# EAGLE design TDA2822M (EAGLE 9.5.2)
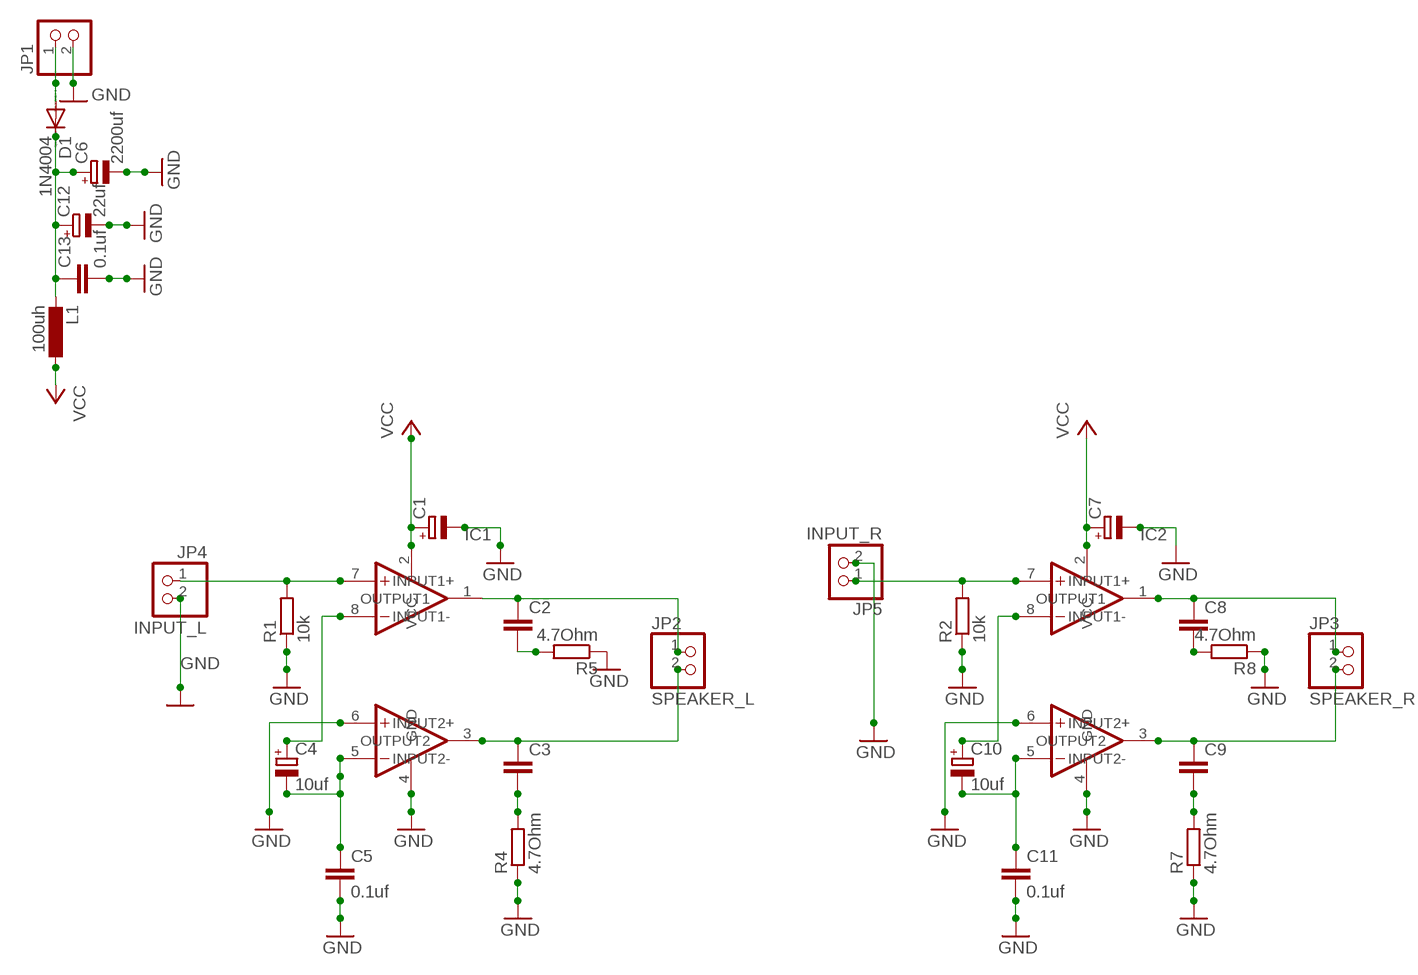
[diagram p0: schematic, sheet 1]

## Parts
C1  CPOL-EUE2.5-7  [E2,5-7]
C2  C-EU025_050-035X075  [C025_050-035X075]
C3  C-EU025_050-035X075  [C025_050-035X075]
C4  10uf  CPOL-EUE2.5-7  [E2,5-7]
C5  0.1uf  C-EU025_050-035X075  [C025_050-035X075]
C6  2200uf  CPOL-EUE3.5-8  [E3,5-8]
C7  CPOL-EUE2.5-7  [E2,5-7]
C8  C-EU025_050-035X075  [C025_050-035X075]
C9  C-EU025_050-035X075  [C025_050-035X075]
C10  10uf  CPOL-EUE2.5-7  [E2,5-7]
C11  0.1uf  C-EU025_050-035X075  [C025_050-035X075]
C12  22uf  CPOL-EUE3.5-8  [E3,5-8]
C13  0.1uf  C2,5-3  [C2.5-3]
D1  1N4004  [DO41-10]
IC1  TDA2822M  [DIL8]
IC2  TDA2822M  [DIL8]
JP1  PINHD-1X2  [1X02]
JP2  SPEAKER_L  PINHD-1X2  [1X02]
JP3  SPEAKER_R  PINHD-1X2  [1X02]
JP4  INPUT_L  PINHD-1X2  [1X02]
JP5  INPUT_R  PINHD-1X2  [1X02]
L1  100uh  L-EU0207/10  [0207/10]
R1  10k  R-EU_0207/10  [0207/10]
R2  10k  R-EU_0207/10  [0207/10]
R4  4.7Ohm  R-EU_0207/10  [0207/10]
R5  4.7Ohm  R-EU_0207/10  [0207/10]
R7  4.7Ohm  R-EU_0207/10  [0207/10]
R8  4.7Ohm  R-EU_0207/10  [0207/10]

## Nets
GND: C1.- C5.2 C6.- C7.- C11.2 C12.- C13.2 IC1.4(GND) IC1.6(INPUT2+) IC2.4(GND) IC2.6(INPUT2+) JP1.2 JP4.2 JP5.2 R1.1 R2.1 R4.1 R5.1 R7.1 R8.1
N$1: C4.+ IC1.8(INPUT1-)
N$2: C4.- C5.1 IC1.5(INPUT2-)
N$3: IC1.7(INPUT1+) JP4.1 R1.2
N$4: C6.+ C12.+ C13.1 D1.C L1.2
N$5: C3.1 IC1.3(OUTPUT2) JP2.2
N$6: C2.1 IC1.1(OUTPUT1) JP2.1
N$7: C3.2 R4.2
N$8: C2.2 R5.2
N$9: D1.A JP1.1
N$11: C9.1 IC2.3(OUTPUT2) JP3.2
N$12: C8.1 IC2.1(OUTPUT1) JP3.1
N$13: C9.2 R7.2
N$14: C8.2 R8.2
N$15: C10.+ IC2.8(INPUT1-)
N$16: C10.- C11.1 IC2.5(INPUT2-)
N$17: IC2.7(INPUT1+) JP5.1 R2.2
VCC: C1.+ C7.+ IC1.2(VCC) IC2.2(VCC) L1.1

## Library data of the parts
C1 C4 C6 C7 C10 C12 = rcl:CPOL-EU: POLARIZED CAPACITOR, European symbol
C2 C3 C5 C8 C9 C11 = resistor:C-EU: CAPACITOR, European symbol
C13 = capacitor-wima:C: CAPACITOR naming: grid - package width
D1 = diode:1N4004: DIODE general purpose rectifier, 1 A
IC1 IC2 = TDA2822M:TDA2822M: TDA2822M - DUAL LOW-VOLTAGE POWER AMPLIFIER
JP1-JP5 = pinhead:PINHD-1X2: PIN HEADER
L1 = rcl:L-EU: INDUCTOR, European symbol
R1 R2 R4 R5 R7 R8 = resistor:R-EU_: RESISTOR, European symbol

## Board
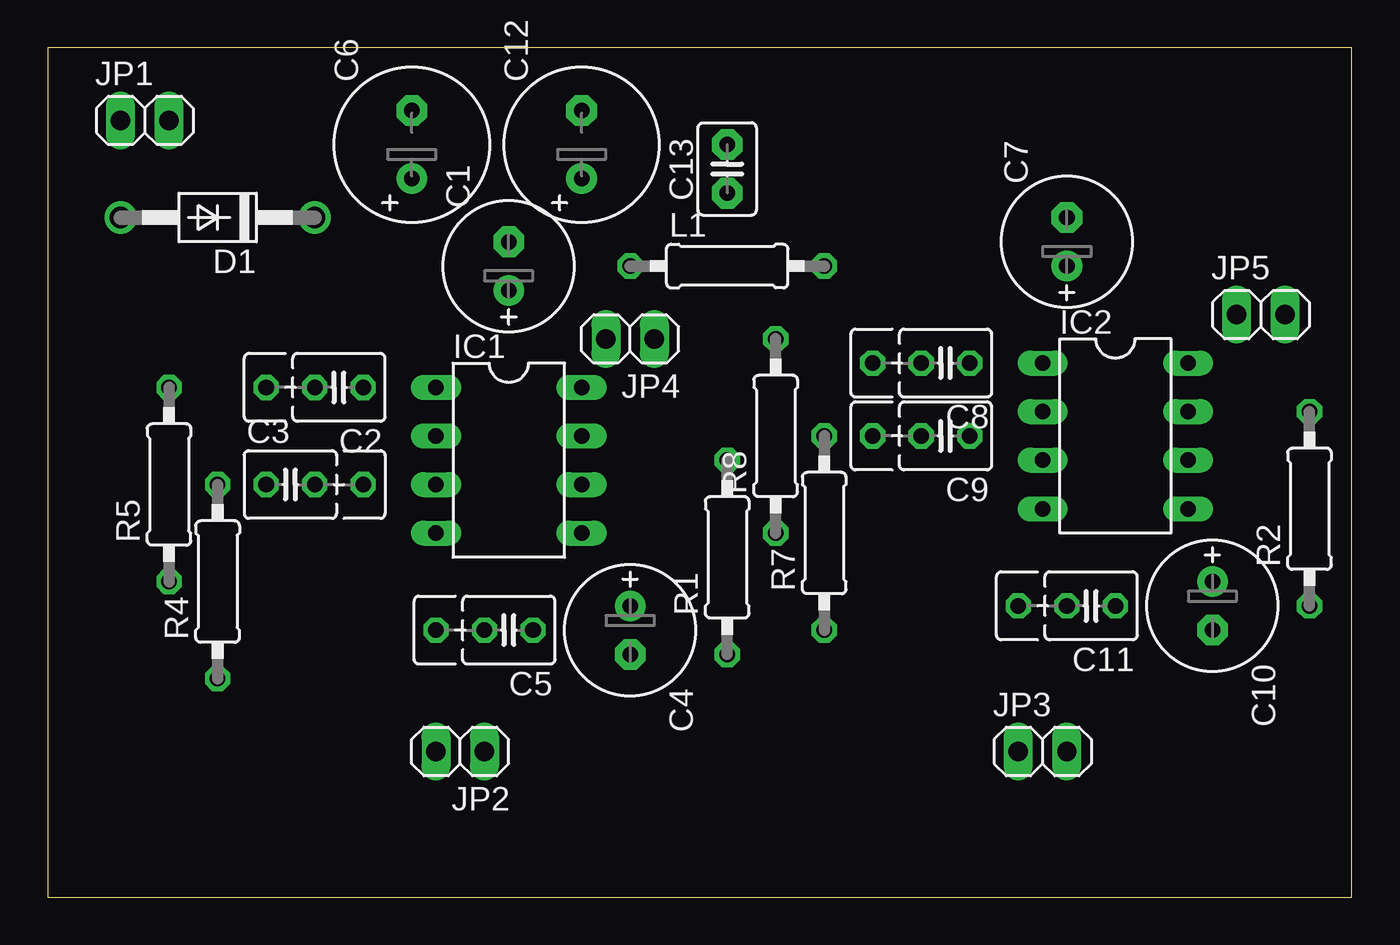
[diagram p1: board, top side]
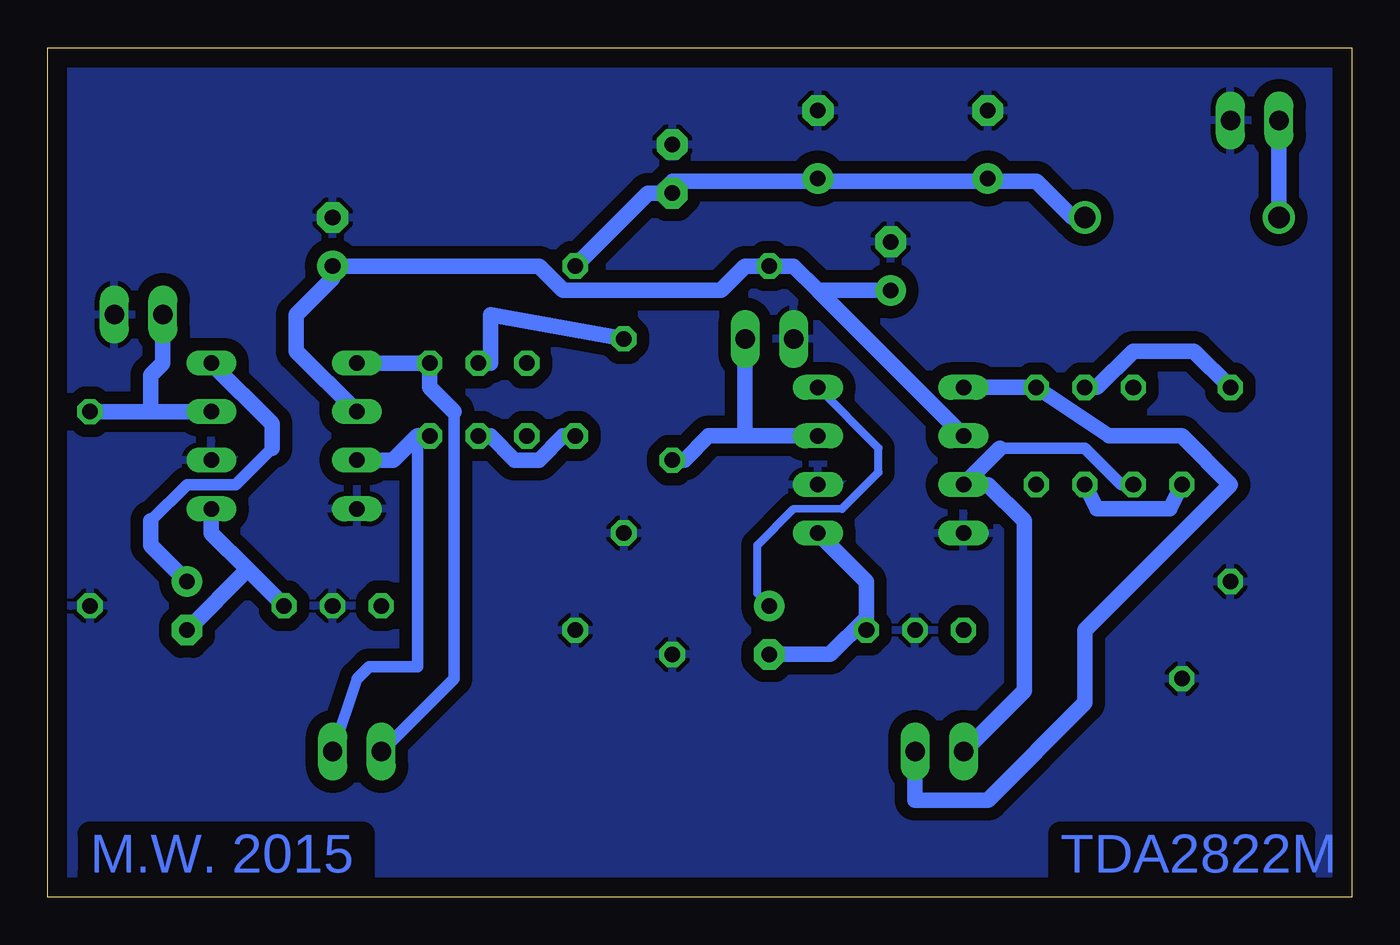
[diagram p2: board, bottom side, seen from below]

Size 68.25 x 44.44 mm. Coordinates in mm from the lower left corner, seen from the top.
Outline: 0,0 68.25,0 68.25,44.44 0,44.44 0,0
Copper layers (1*16): Top 0.035mm / dielectric 1.5mm / Bottom 0.035mm
Design rules "default *": minimum track width 15mil, minimum drill 30mil, track to track 8mil, track to pad 8mil, pad to pad 8mil, via to via 8mil, smd to smd 8mil, copper to edge 40mil, drill to drill 8mil, minimum pad ring 10mil, minimum via ring 8mil, stop-mask expansion 4mil, vias tented up to drill 0mil, thermal gap 10mil

### Footprints (pad centres in the part's own frame; a part is rotated, then mirrored left to right if it is on the bottom)
E2,5-7 = drill 0.813 pad 1.6: + -1.27,0 | drill 0.813 pad 1.6 octagon: - 1.27,0
C025_050-035X075 = drill 0.813 octagon: 1 -1.27,0; 2 1.27,0; 3 3.81,0
E3,5-8 = drill 0.813 pad 1.6: + -1.778,0 | drill 0.813 pad 1.6 octagon: - 1.778,0
C2.5-3 = drill 0.813 pad 1.6 octagon: 1 -1.27,0; 2 1.27,0
DO41-10 = drill 1.118: A 5.08,0; C -5.08,0
DIL8 = drill 0.813 long: 1 -3.81,-3.81; 2 -1.27,-3.81; 3 1.27,-3.81; 4 3.81,-3.81; 5 3.81,3.81; 6 1.27,3.81; 7 -1.27,3.81; 8 -3.81,3.81
1X02 = drill 1.016 long: 1 -1.27,0; 2 1.27,0
0207/10 = drill 0.813 octagon: 1 -5.08,0; 2 5.08,0

### Placement (x,y rotation side)
C1  24.13,33.02 90 top
C2  15.24,26.67 180 top
C3  12.7,21.59 0 top
C4  30.48,13.97 270 top
C5  24.13,13.97 180 top
C6  19.05,39.37 90 top
C7  53.34,34.29 90 top
C8  46.99,27.94 180 top
C9  46.99,24.13 180 top
C10  60.96,15.24 270 top
C11  54.61,15.24 180 top
C12  27.94,39.37 90 top
C13  35.56,38.1 90 top
D1  8.89,35.56 180 top
IC1  24.13,22.86 270 top
IC2  55.88,24.13 270 top
JP1  5.08,40.64 0 top
JP2  21.59,7.62 180 top
JP3  52.07,7.62 0 top
JP4  30.48,29.21 180 top
JP5  63.5,30.48 0 top
L1  35.56,33.02 0 top
R1  35.56,17.78 90 top
R2  66.04,20.32 90 top
R4  8.89,16.51 90 top
R5  6.35,21.59 90 top
R7  40.64,19.05 90 top
R8  38.1,24.13 90 top

### Tracks (layer width: path | path; a pad name or v marks a point on that pad's centre or on a via)
GND
  pour Bottom (isolate 0.65): 0,44.45 68.58,44.45 68.58,0 0,0
N$1
  Bottom 0.381: 29.21,20.32 26.67,20.32 | C4.+ 31.11,15.88
  Bottom 0.406: IC1.8 24.77,23.49 24.77,22.22 26.67,20.32 | 29.21,20.32 31.11,18.41 31.11,15.88
N$2
  Bottom 0.381: 25.4,14.6 C5.1
  Bottom 0.813: IC1.5 25.4,16.51 25.4,14.6 27.3,12.7 C4.-
N$3
  Bottom 0.813: 31.75,24.13 33.66,24.13 34.92,22.86 R1.2 | 31.75,24.13 IC1.7 | 31.75,24.13 JP4.1
N$4
  Bottom 0.381: 19.05,37.47 C6.+ | 27.94,37.47 C12.+
  Bottom 0.813: D1.C 14.61,35.56 16.51,37.47 19.05,37.47 27.94,37.47 35.56,37.47 36.2,36.83 | L1.2 36.83,36.83 36.2,36.83 | 36.2,36.83 C13.1
N$5
  Bottom 0.381: 12.06,21.59 C3.1
  Bottom 0.61: 12.06,21.59 13.97,23.49 18.41,23.49
  Bottom 0.813: 18.41,23.49 IC1.3 19.05,21.59 17.14,19.68 17.14,10.79 JP2.2
N$6
  Bottom 0.813: IC1.1 C2.1 12.7,24.13 8.89,24.13 6.35,21.59 13.97,13.97 13.97,10.16 19.05,5.08 22.86,5.08 JP2.1
N$7
  Bottom 0.813: R4.2 9.53,20.32 13.34,20.32 C3.2
N$8
  Bottom 0.813: R5.2 8.26,28.58 11.43,28.58 13.34,26.67 C2.2
N$9
  Bottom 0.813: D1.A JP1.1
N$11
  Bottom 0.61: JP3.2 52.07,11.43 51.44,12.06 48.9,12.06 48.9,24.13 C9.1
  Bottom 0.813: 48.9,24.13 50.16,22.86 IC2.3
N$12
  Bottom 0.61: JP3.1 46.99,11.43 46.99,25.4
  Bottom 0.813: IC2.1 C8.1 48.26,26.67 46.99,25.4
N$13
  Bottom 0.813: R7.2 41.27,24.13 42.55,22.86 43.81,22.86 45.09,24.13 C9.2
N$14
  Bottom 0.813: R8.2 45.09,30.48 45.09,27.94 C8.2
N$15
  Bottom 0.61: 56.52,23.49 58.42,21.59 60.96,21.59 62.87,19.68
  Bottom 0.813: IC2.8 56.52,24.77 56.52,23.49 | 62.87,19.68 62.87,18.41 C10.+
N$16
  Bottom 0.813: 57.78,17.14 59.69,19.05 IC2.5 | 57.78,17.14 C11.1 | 57.78,17.14 C10.-
N$17
  Bottom 0.813: R2.2 62.87,25.4 | 62.87,25.4 IC2.7 | JP5.1 62.23,27.94 62.87,27.3 62.87,25.4
VCC
  Bottom 0.813: IC2.2 55.24,28.58 55.24,30.48 53.34,32.38 C7.+ 42.55,33.02 41.27,31.75 33.02,31.75 31.75,33.02 L1.1 29.21,33.02 27.94,31.75 | 27.94,31.75 IC1.2 | 27.94,31.75 C1.+

### Text on the board
Bottom: TDA2822M | M.W. 2015